# Altium schematic sheet STM32 Input Conditioning.SchDoc
size A
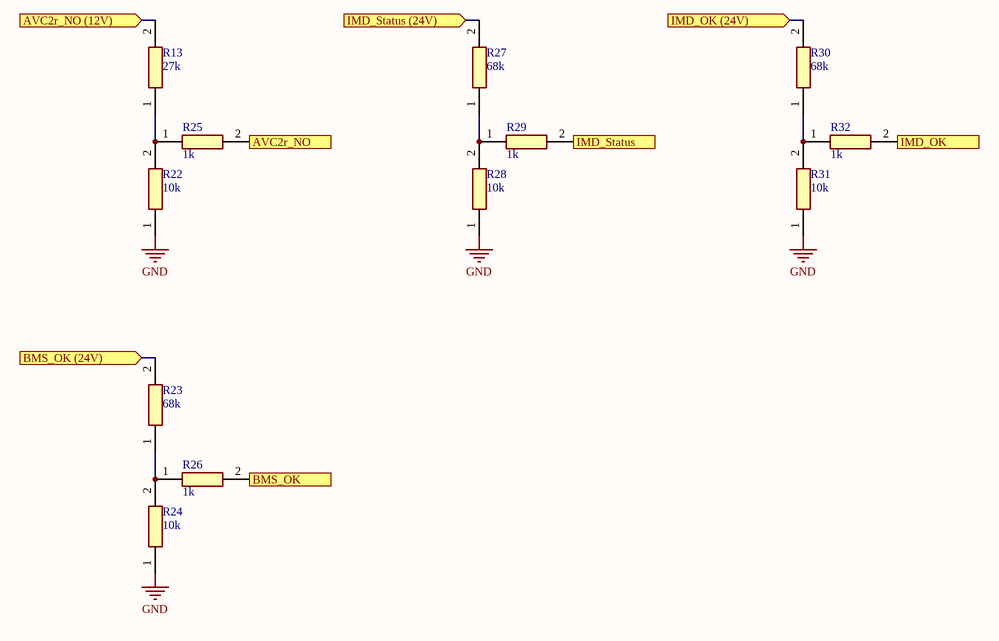
[diagram p0: STM32 Input Conditioning.SchDoc]

## Parts
R13  27k  [RESC1608X55N]
R22  10k  [RESC1608X55N]
R23  68k  [RESC1608X55N]
R24  10k  [RESC1608X55N]
R25  1k  [RESC1608X55N]
R26  1k  [RESC1608X55N]
R27  68k  [RESC1608X55N]
R28  10k  [RESC1608X55N]
R29  1k  [RESC1608X55N]
R30  68k  [RESC1608X55N]
R31  10k  [RESC1608X55N]
R32  1k  [RESC1608X55N]

## Ports
AVC2r_NO (12V) (in), AVC2r_NO (out), BMS_OK (24V) (in), BMS_OK (out), IMD_OK (24V) (in), IMD_OK (out), IMD_Status (24V) (in), IMD_Status (out)

## Nets
GND: R22.1 R24.1 R28.1 R31.1
AVC2r_NO: R25.2 ; port AVC2r_NO
AVC2r_NO (12V): R13.2 ; port AVC2r_NO (12V)
BMS_OK: R26.2 ; port BMS_OK
BMS_OK (24V): R23.2 ; port BMS_OK (24V)
IMD_OK: R32.2 ; port IMD_OK
IMD_OK (24V): R30.2 ; port IMD_OK (24V)
IMD_Status: R29.2 ; port IMD_Status
IMD_Status (24V): R27.2 ; port IMD_Status (24V)
NetR13_1: R13.1 R22.2 R25.1
NetR23_1: R23.1 R24.2 R26.1
NetR27_1: R27.1 R28.2 R29.1
NetR30_1: R30.1 R31.2 R32.1

## Library data of the parts
R13 = TNPW060327K0BEEA: Resistor; Manufacturer_Name: Vishay; Datasheet Link: https://componentsearchengine.com/Datasheets/1/TNPW060327K0BEEA.pdf; Height: 0.55mm; Manufacturer_Part_Number: TNPW060327K0BEEA; Mouser Part Number: 71-TNPW060327K0BEEA; Mouser Price/Stock: https://www.mouser.co.uk/ProductDetail/Vishay-Dale/TNPW060327K0BEEA?qs=rhzOH%252BTaZWuJVeAMpnOOjQ%3D%3D; Arrow Part Number: TNPW060327K0BEEA; Arrow Price/Stock: https://www.arrow.com/en/products/tnpw060327k0beea/vishay
R22 R24 R28 R31 = CRGCQ0603F10K: Resistor; Manufacturer_Name: TE Connectivity; Datasheet Link: https://www.te.com/commerce/DocumentDelivery/DDEController?Action=showdoc&DocId=Data+Sheet%7F1773204-3%7F1%7Fpdf%7FEnglish%7FENG_DS_1773204-3_1.pdf%7F5-2176339-2; Height: 0.55mm; Manufacturer_Part_Number: CRGCQ0603F10K; Mouser Part Number: 279-CRGCQ0603F10K; Mouser Price/Stock: https://www.mouser.co.uk/ProductDetail/TE-Connectivity-Holsworthy/CRGCQ0603F10K?qs=wUXugUrL1qxhM765MzQWJg%3D%3D; Arrow Part Number: CRGCQ0603F10K; Arrow Price/Stock: https://www.arrow.com/en/products/crgcq0603f10k/te-connectivity?region=nac
R23 R27 R30 = MCT06030D6802BP500: Resistor; Manufacturer_Name: Vishay; Datasheet Link: http://www.vishay.com/docs/28705/mcx0x0xpro.pdf; Height: 0.55mm; Manufacturer_Part_Number: MCT06030D6802BP500
R25 R26 R29 R32 = RMCF0603JT1K00: Resistor; Manufacturer_Name: Stackpole Electronics; Datasheet Link: https://www.seielect.com/Catalog/SEI-RMCF_RMCP.pdf; Height: 0.55mm; Manufacturer_Part_Number: RMCF0603JT1K00; Mouser Part Number: 708-RMCF0603JT1K00; Mouser Price/Stock: https://www.mouser.co.uk/ProductDetail/SEI-Stackpole/RMCF0603JT1K00?qs=FESYatJ8odK3lrUeqnFxyg%3D%3D; Arrow Part Number: RMCF0603JT1K00; Arrow Price/Stock: https://www.arrow.com/en/products/rmcf0603jt1k00/stackpole-electronics?region=nac